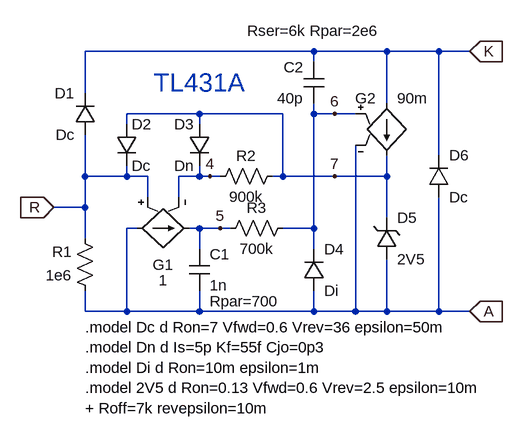
[diagram p0: schematic TL431AS.asc]
TL431AS.asc, the LTspice schematic file:
Version 4
SHEET 1 1252 680
WIRE 624 -320 272 -320
WIRE 736 -320 624 -320
WIRE 816 -320 736 -320
WIRE 864 -320 816 -320
WIRE 624 -304 624 -320
WIRE 272 -256 272 -320
WIRE 736 -240 736 -320
WIRE 448 -224 336 -224
WIRE 576 -224 448 -224
WIRE 624 -224 624 -240
WIRE 656 -224 624 -224
WIRE 688 -224 656 -224
WIRE 336 -208 336 -224
WIRE 448 -208 448 -224
WIRE 816 -160 816 -320
WIRE 272 -128 272 -192
WIRE 336 -128 336 -144
WIRE 336 -128 272 -128
WIRE 368 -128 336 -128
WIRE 448 -128 448 -144
WIRE 448 -128 416 -128
WIRE 464 -128 448 -128
WIRE 480 -128 464 -128
WIRE 576 -128 576 -224
WIRE 576 -128 560 -128
WIRE 656 -128 576 -128
WIRE 736 -128 736 -160
WIRE 736 -128 656 -128
WIRE 368 -96 368 -128
WIRE 416 -96 416 -128
WIRE 272 -80 272 -128
WIRE 272 -80 224 -80
WIRE 736 -64 736 -128
WIRE 352 -48 336 -48
WIRE 448 -48 432 -48
WIRE 480 -48 448 -48
WIRE 496 -48 480 -48
WIRE 624 -48 624 -224
WIRE 624 -48 576 -48
WIRE 272 -32 272 -80
WIRE 448 -16 448 -48
WIRE 624 -16 624 -48
WIRE 272 80 272 48
WIRE 336 80 336 -48
WIRE 336 80 272 80
WIRE 448 80 448 48
WIRE 448 80 336 80
WIRE 624 80 624 48
WIRE 624 80 448 80
WIRE 688 80 688 -176
WIRE 688 80 624 80
WIRE 736 80 736 0
WIRE 736 80 688 80
WIRE 816 80 816 -96
WIRE 816 80 736 80
WIRE 864 80 816 80
FLAG 224 -80 R
IOPIN 224 -80 In
FLAG 864 -320 K
IOPIN 864 -320 In
FLAG 864 80 A
IOPIN 864 80 In
FLAG 464 -128 4
FLAG 480 -48 5
FLAG 656 -224 6
FLAG 656 -128 7
SYMBOL diode 288 -192 R180
WINDOW 0 32 64 Left 2
WINDOW 3 32 0 Left 2
SYMATTR InstName D1
SYMATTR Value Dc
SYMBOL res 288 64 R180
WINDOW 0 36 76 Left 2
WINDOW 3 36 40 Left 2
SYMATTR InstName R1
SYMATTR Value 1e6
SYMBOL g2 448 -48 R90
WINDOW 0 56 56 VCenter 2
WINDOW 3 80 56 VCenter 2
SYMATTR InstName G1
SYMATTR Value 1
SYMBOL cap 432 -16 R0
WINDOW 0 32 8 Left 2
WINDOW 3 32 56 Left 2
WINDOW 39 32 80 Left 2
SYMATTR InstName C1
SYMATTR Value 1n
SYMATTR SpiceLine Rpar=700
SYMBOL diode 320 -208 R0
SYMATTR InstName D2
SYMATTR Value Dc
SYMBOL diode 464 -208 M0
SYMATTR InstName D3
SYMATTR Value Dn
SYMBOL res 576 -144 R90
WINDOW 0 0 56 VBottom 2
WINDOW 3 32 56 VTop 2
SYMATTR InstName R2
SYMATTR Value 900k
SYMBOL res 592 -64 R90
WINDOW 0 0 56 VBottom 2
WINDOW 3 32 56 VTop 2
SYMATTR InstName R3
SYMATTR Value 700k
SYMBOL diode 608 48 M180
WINDOW 0 32 64 Left 2
WINDOW 3 32 0 Left 2
SYMATTR InstName D4
SYMATTR Value Di
SYMBOL cap 640 -304 M0
WINDOW 0 32 8 Left 2
WINDOW 3 32 56 Left 2
WINDOW 39 16 -32 Bottom 2
SYMATTR InstName C2
SYMATTR Value 40p
SYMATTR SpiceLine Rser=6k Rpar=2e6
SYMBOL g2 736 -144 M180
WINDOW 0 -16 104 Right 2
WINDOW 3 16 104 Left 2
SYMATTR InstName G2
SYMATTR Value 90m
SYMBOL zener 720 0 M180
WINDOW 0 32 64 Left 2
WINDOW 3 32 0 Left 2
SYMATTR InstName D5
SYMATTR Value 2V5
SYMATTR Description Diode
SYMATTR Type diode
SYMBOL diode 800 -96 M180
WINDOW 0 32 64 Left 2
WINDOW 3 32 0 Left 2
SYMATTR InstName D6
SYMATTR Value Dc
TEXT 272 104 Left 2 !.model Dc d Ron=7 Vfwd=0.6 Vrev=36 epsilon=50m\n.model Dn d Is=5p Kf=55f Cjo=0p3\n.model Di d Ron=10m epsilon=1m\n.model 2V5 d Ron=0.13 Vfwd=0.6 Vrev=2.5 epsilon=10m\n+ Roff=7k revepsilon=10m
TEXT 448 -272 Center 4 ;TL431A

The netlist it stands for:
* TL431AS.asc
D1 R K Dc
R1 A R 1e6
G1 A 5 R 4 1
C1 5 A 1n Rpar=700
D2 7 R Dc
D3 7 4 Dn
R2 7 4 900k
R3 6 5 700k
D4 A 6 Di
C2 K 6 40p Rser=6k Rpar=2e6
G2 K 7 6 A 90m
D5 A 7 2V5
D6 A K Dc
.model D D
.lib standard.dio
.model Dc d Ron=7 Vfwd=0.6 Vrev=36 epsilon=50m
.model Dn d Is=5p Kf=55f Cjo=0p3
.model Di d Ron=10m epsilon=1m
.model 2V5 d Ron=0.13 Vfwd=0.6 Vrev=2.5 epsilon=10m
+ Roff=7k revepsilon=10m
* TL431A
.backanno
.end